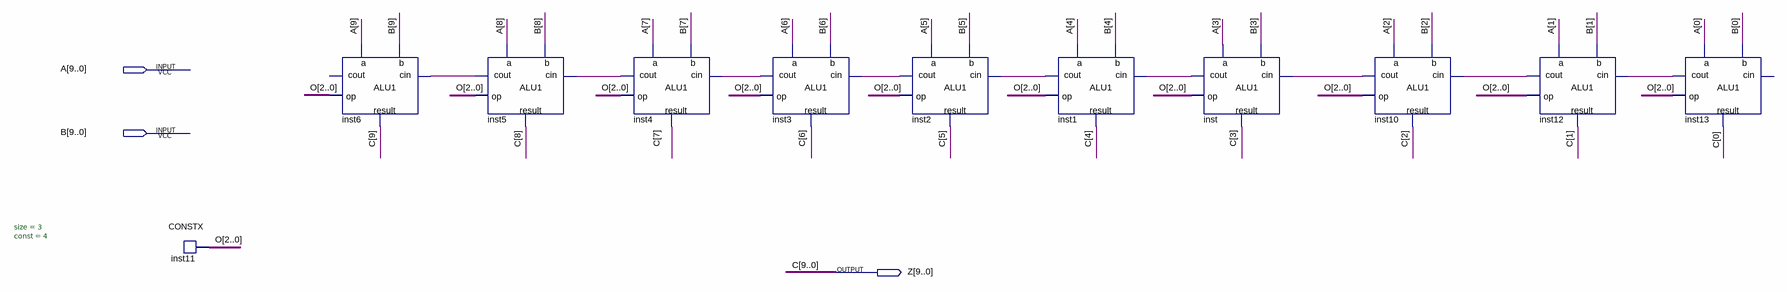
[diagram p0: schematic sheet]
// Quartus schematic ADD.bdf as structural Verilog: 11 symbols, 3 pins
module ADD (
  input  [9:0] A,
  input  [9:0] B,
  output [9:0] Z
);

  wire inst1_cout, inst2_cout, inst3_cout, inst4_cout, inst5_cout, inst10_cout, inst12_cout, inst13_cout,
       inst_cout;
  wire [2:0] O;

  CONSTX #(.size(3), .\const (4)) inst11 (.data(O));
  ALU1 inst6 (.a(A[9]), .b(B[9]), .cin(inst5_cout), .op(O), .result(Z[9]));  // open: cout
  ALU1 inst5 (.a(A[8]), .b(B[8]), .cin(inst4_cout), .op(O), .cout(inst5_cout), .result(Z[8]));
  ALU1 inst4 (.a(A[7]), .b(B[7]), .cin(inst3_cout), .op(O), .cout(inst4_cout), .result(Z[7]));
  ALU1 inst3 (.a(A[6]), .b(B[6]), .cin(inst2_cout), .op(O), .cout(inst3_cout), .result(Z[6]));
  ALU1 inst2 (.a(A[5]), .b(B[5]), .cin(inst1_cout), .op(O), .cout(inst2_cout), .result(Z[5]));
  ALU1 inst1 (.a(A[4]), .b(B[4]), .cin(inst_cout), .op(O), .cout(inst1_cout), .result(Z[4]));
  ALU1 inst (.a(A[3]), .b(B[3]), .cin(inst10_cout), .op(O), .cout(inst_cout), .result(Z[3]));
  ALU1 inst10 (.a(A[2]), .b(B[2]), .cin(inst12_cout), .op(O), .cout(inst10_cout), .result(Z[2]));
  ALU1 inst12 (.a(A[1]), .b(B[1]), .cin(inst13_cout), .op(O), .cout(inst12_cout), .result(Z[1]));
  ALU1 inst13 (.a(A[0]), .b(B[0]), .op(O), .cout(inst13_cout), .result(Z[0]));  // open: cin

  // Other names for the same wires on the sheet: C[9:0] = Z
endmodule
